# EAGLE design Black_PSI_Controller (EAGLE 9.1.2)
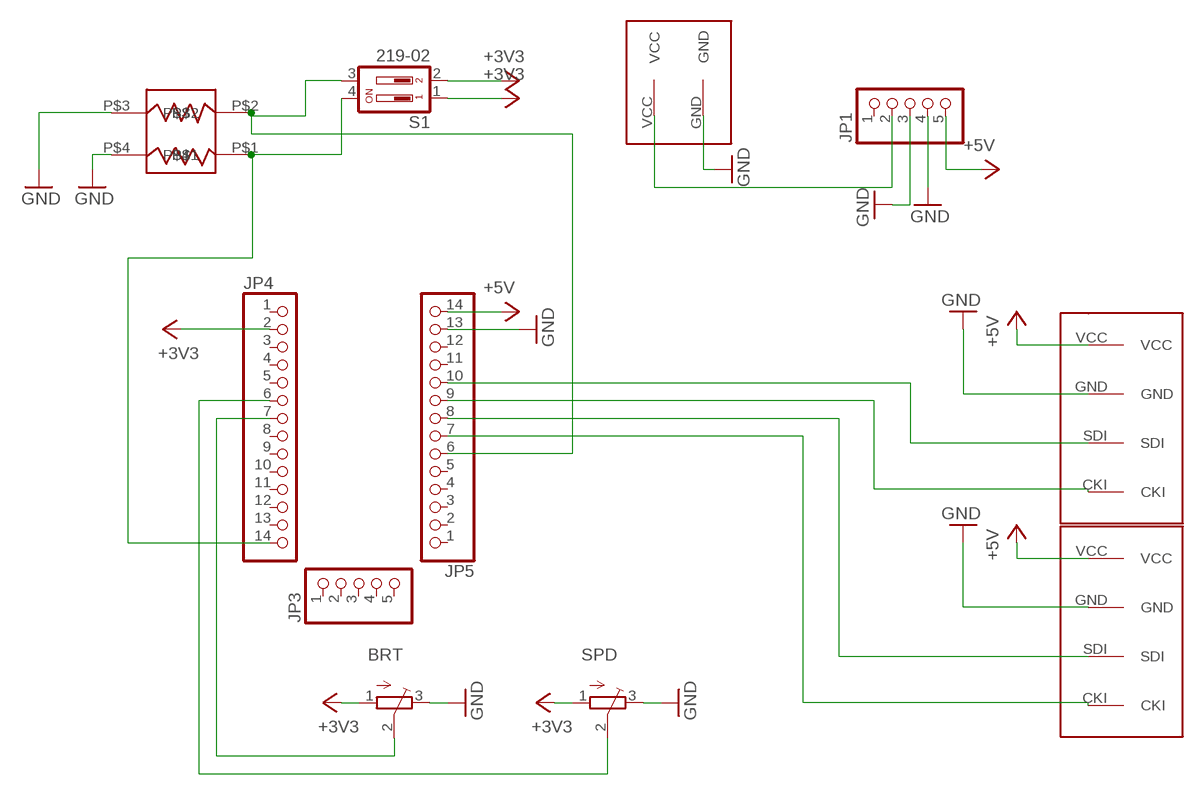
[diagram p0: schematic, sheet 1]

## Parts
BRT  TRIMPOTTC33X  [TC33X]
JP1  PINHD-1X5  [1X05]
JP3  PINHD-1X5  [1X05]
JP4  PINHD-1X14  [1X14]
JP5  PINHD-1X14  [1X14]
S1  219-02  [CTS-219-02]
SPD  TRIMPOTTC33X  [TC33X]
U$1  0393570002WIRE-TO-BOARD  [0393570002WIRE-TO-BOARD]
U$2  0393570004WIRE-TO-BOARD  [0393570004WIRE-TO-BOARD]
U$3  0393570004WIRE-TO-BOARD  [0393570004WIRE-TO-BOARD]
U$4  ACASN1002S1002P1AT  [ACASN1002S1002P1AT]

## Nets
+3V3: BRT.1(A) JP4.2 S1.1 S1.2 SPD.1(A)
+5V: JP1.5 JP5.14 U$2.VCC U$3.VCC
GND: BRT.3(E) JP1.3 JP1.4 JP5.13 SPD.3(E) U$1.GND U$2.GND U$3.GND U$4.P$3 U$4.P$4
N$1: JP4.6 SPD.2(S)
N$2: BRT.2(S) JP4.7
N$3: JP1.2 U$1.VCC
N$5: JP5.10 U$2.SDI
N$6: JP5.9 U$2.CKI
N$7: JP5.8 U$3.SDI
N$8: JP5.7 U$3.CKI
N$10: JP4.14 S1.4 U$4.P$1
N$11: JP5.6 S1.3 U$4.P$2
Unconnected: JP1.1 JP3.1 JP3.2 JP3.3 JP3.4 JP3.5 JP4.1 JP4.3 JP4.4 JP4.5 JP4.8 JP4.9 JP4.10 JP4.11 JP4.12 JP4.13 JP5.1 JP5.2 JP5.3 JP5.4 JP5.5 JP5.11 JP5.12

## Library data of the parts
BRT SPD = adafruit:TRIMPOT: SMT trimmer potentiometer part number TC33X http://www.ladyada.net/library/eagle
JP1 JP3 = pinhead:PINHD-1X5: PIN HEADER
JP4 JP5 = pinhead:PINHD-1X14: PIN HEADER
S1 = switch-dil:219-02*: Surface Mount DIP Switch Series 219 SMT CTS Electronic Components Sourc: www.ctscorp.com; OC_FARNELL: unknown; OC_NEWARK: unknown
U$1 = R2-PSI:0393570002WIRE-TO-BOARD
U$2 U$3 = R2-PSI:0393570004WIRE-TO-BOARD
U$4 = R2-PSI:ACASN1002S1002P1AT

## Board
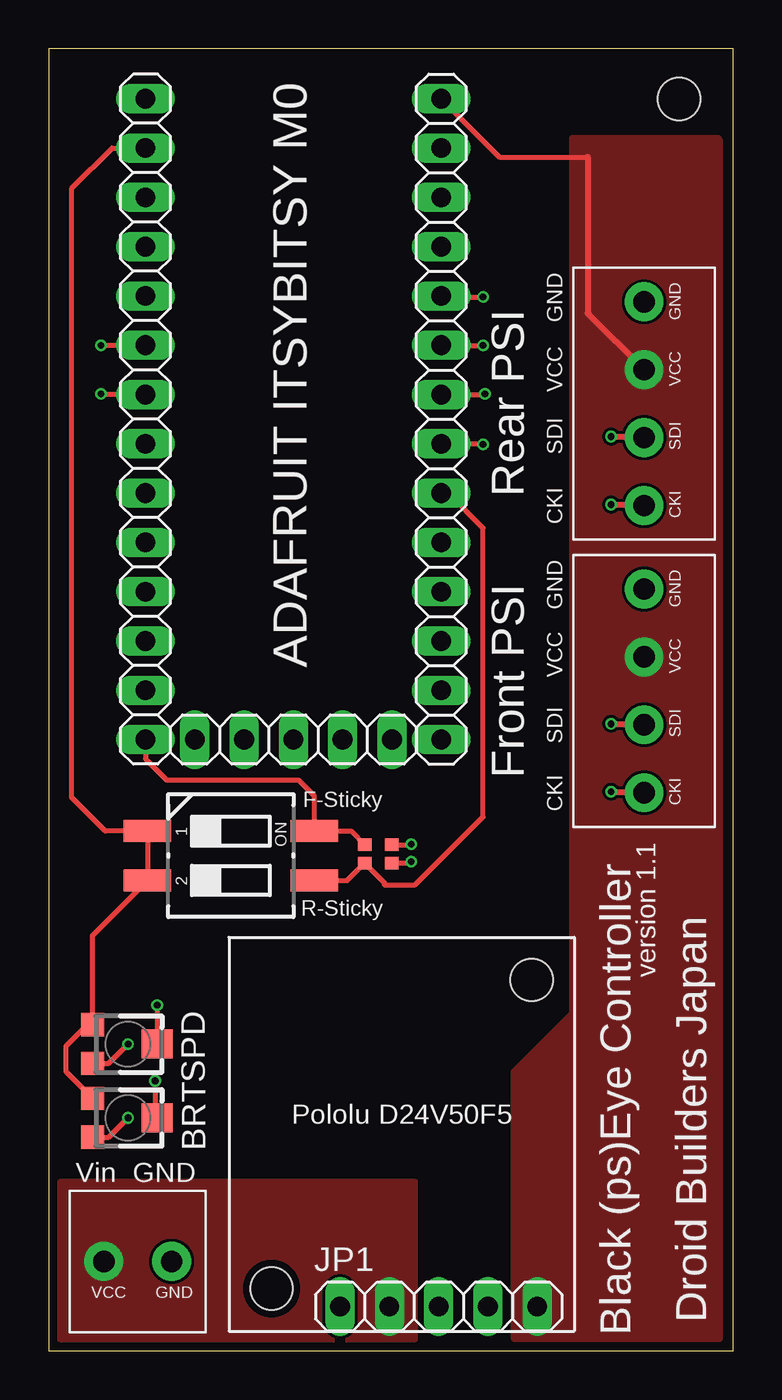
[diagram p1: board, top side]
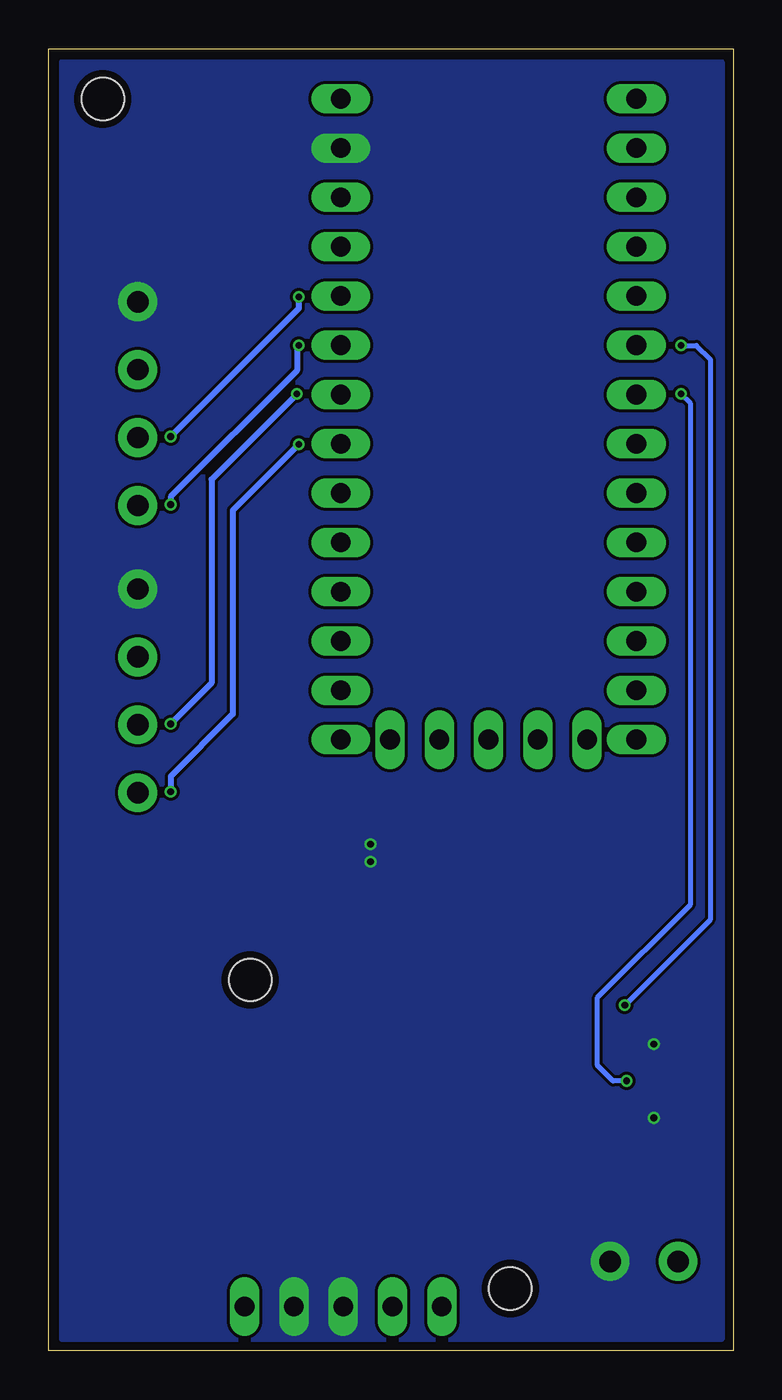
[diagram p2: board, bottom side, seen from below]

Size 35.3 x 67.1 mm. Coordinates in mm from the lower left corner, seen from the top.
Outline: 0,0 35.3,0 35.3,67.1 0,67.1 0,0
Copper layers (1*16): Top 0.035559375mm / dielectric 1.6mm / Bottom 0.035559375mm
Design rules "oshpark-2layer *": minimum track width 6mil, minimum drill 10mil, track to track 6mil, track to pad 6mil, pad to pad 6mil, via to via 6mil, smd to smd 6mil, copper to edge 15mil, drill to drill 6mil, minimum pad ring 5mil, minimum via ring 5mil, stop-mask expansion 2.5mil, vias tented up to drill 20mil, thermal gap 0mil
Holes 2.18 mm at 11.5,3.2 24.9,19.1 32.5,64.5

### Footprints (pad centres in the part's own frame; a part is rotated, then mirrored left to right if it is on the bottom)
TC33X = smd 1.2 x 1.2: 1 -1,-1.825; 3 1,-1.825 | smd 1.5 x 1.6: 2 0,1.5
1X05 = drill 1.016 long: 1 -5.08,0; 2 -2.54,0; 3 0,0; 4 2.54,0; 5 5.08,0
1X14 = drill 1.016 long: 1 -16.51,0; 2 -13.97,0; 3 -11.43,0; 4 -8.89,0; 5 -6.35,0; 6 -3.81,0; 7 -1.27,0; 8 1.27,0; 9 3.81,0; 10 6.35,0; 11 8.89,0; 12 11.43,0; 13 13.97,0; 14 16.51,0
CTS-219-02 = smd 1.13 x 2.44: 1 -1.27,-4.3; 2 1.27,-4.3; 3 1.27,4.3; 4 -1.27,4.3
0393570002WIRE-TO-BOARD = drill 1.1 pad 2: GND 1.75,0; VCC -1.75,0
0393570004WIRE-TO-BOARD = drill 1.1 pad 2: CKI -5.25,0; GND 5.25,0; SDI -1.75,0; VCC 1.75,0
ACASN1002S1002P1AT = smd 0.64 x 0.7: P$1 -0.47,-0.7; P$2 0.47,-0.7; P$3 0.47,0.7; P$4 -0.47,0.7

### Placement (x,y rotation side)
BRT  4.1,12 270 top
JP1  20.11,2.27 0 top
JP3  12.62,31.49 0 top
JP4  5,48 270 top
JP5  20.24,48 90 top
S1  9.4,25.5 270 top
SPD  4.1,15.8 270 top
U$1  4.6,4.6 0 top
U$2  30.7,48.8 90 top
U$3  30.7,34 90 top
U$4  17,25.6 270 top

### Tracks (layer width: path | path; a pad name or v marks a point on that pad's centre or on a via)
+3V3
  Top 0.254: BRT.1 0.9,14.38 0.9,15.7 2,16.8 SPD.1 2.27,21.41 S1.2 S1.1 2.93,26.77 1.2,28.5 1.2,59.9 3.27,61.97 JP4.2
+5V
  Top 0.254: JP5.14 23.25,61.5 27.8,61.5
  Top 0.305: U$2.VCC 27.8,53.45 27.8,61.5
  pour Top: 24,0.6 24,14.4 27,17.4 27,62.5 34.5,62.5 34.6,62.4 34.6,0.6
GND  (via drill 0.35)
  Top 0.254: SPD.3 3.1,14.8 v4.1,15.8 | BRT.3 3.1,11 v4.1,12 | U$4.P$4 18.67,26.07 v18.7,26.1 | U$4.P$3 18.63,25.13 v18.7,25.2
  pour Bottom: 0.6,0.6 34.6,0.6 34.6,66.4 0.6,66.4
N$1  (via drill 0.35)
  Top 0.254: JP4.6 v2.7,51.8 | v5.6,17.8 SPD.2
  Bottom 0.254: v2.7,51.8 1.9,51.8 1.2,51.1 1.2,22.2 v5.6,17.8
N$2  (via drill 0.35)
  Top 0.254: JP4.7 2.73,49.27 v2.7,49.3 | v5.5,13.9 5.5,12.1 BRT.2
  Bottom 0.254: v5.5,13.9 6.2,13.9 7,14.7 7,18.2 2.2,23 2.2,48.8 v2.7,49.3
N$3
  pour Top: 0.6,0.6 18.9,0.6 18.9,8.7 0.6,8.7
N$5  (via drill 0.35)
  Top 0.254: JP5.10 20.29,54.3 v22.4,54.3
  Top 0.305: v29,47.1 30.65,47.1 U$2.SDI
  Bottom 0.305: v22.4,54.3 22.4,53.7 v29,47.1
N$6  (via drill 0.35)
  Top 0.254: U$2.CKI 30.65,43.6 | JP5.9 v22.4,51.8
  Top 0.305: v29,43.6 30.65,43.6 U$2.CKI
  Bottom 0.305: v22.4,51.8 22.5,51.7 22.5,50.5 29,44 v29,43.6
N$7  (via drill 0.35)
  Top 0.254: U$3.SDI 30.65,32.3 | JP5.8 22.47,49.27 v22.5,49.3
  Top 0.305: v29,32.3 30.65,32.3 U$3.SDI
  Bottom 0.305: v22.5,49.3 26.9,44.9 26.9,34.4 v29,32.3
N$8  (via drill 0.35)
  Top 0.254: JP5.7 22.37,46.73 v22.4,46.7
  Top 0.305: v29,28.8 30.65,28.8 U$3.CKI
  Bottom 0.305: v22.4,46.7 25.8,43.3 25.8,32.8 29,29.6 v29,28.8
N$10
  Top 0.254: U$4.P$1 15.6,26.77 S1.4 13.7,28.6 12.9,29.4 6.1,29.4 5,30.5 JP4.14
N$11
  Top 0.254: S1.3 15.4,24.23 U$4.P$2 17.3,24.13 17.3,24 18.9,24 22.4,27.5 22.4,42.4 20.61,44.19 JP5.6

### Text on the board
tPlace: GND | VCC | SDI | Rear PSI | CKI | GND | ADAFRUIT ITSYBITSY M0 | VCC | SDI | Front PSI | F-Sticky | CKI | version 1.1 | R-Sticky | Droid Builders Japan | Pololu D24V50F5 | Vin GND | Black (ps)Eye Controller